# Altium schematic sheet LED_Module.SchDoc: LED Module
size A; Author: Jenova DeBrosse; SheetNumber: 1; SheetTotal: 1; TeamLead: John Ulm; ProjectTitle: LED Module
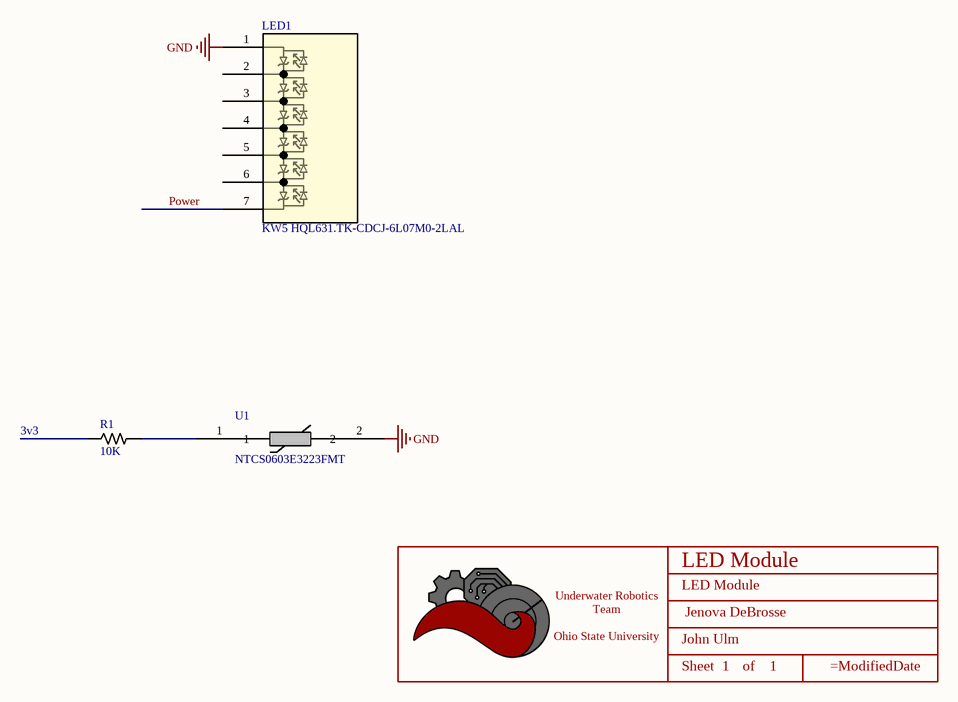
[diagram p0: LED_Module.SchDoc]

## Parts
*  Title_Block  [LOGO]  (value not drawn)  (graphical)
LED1  KW5 HQL631.TK-CDCJ-6L07M0-2LAL  [KW5HQL_OSR]
R1  Value  (Ohms): 10K  [RESISTOR_0603]  (hidden comment: 10k Ohm 0.5% 1/10W)
U1  NTCS0603E3223FMT  [NTCS0603_VIS]

## Nets
GND: LED1.1 U1.2
Power: LED1.7
NetR1_1: R1.1 U1.1

Not connected (* = marked no-connect by the designer): LED1 2 3 4 5 6; R1 2

## Notes on the sheet
- 3v3
- (in symbol Title_Block) Underwater Robotics Team / Ohio State University; Sheet; of

## Library data of the parts
* = Title_Block: UWRT Schematic Title Block Template / Created June 2021, Dylan Trainor
LED1 = KW5 HQL631.TK-CDCJ-6L07M0-2LAL: No Description Available; Mfr_Name: ams OSRAM; Type: LED Lighting; RefDes: RefDes
R1 = RESISTOR_10K_0.5%_0603: RES 10k OHM 0.5% 1/10W 0603; Tolerance: +/- 0.5%; Made By: Robert Pafford; Wattage: 1/10W; Supplier: Digikey; Digikey Part Numer: CR0603-JW-104ELFTR-ND; Supplier 1: Digi-Key; Supplier Part Number 1: 749-1695-1-ND
U1 = CMP-00030-42631939-1: NTCS0603E3223FMT Thermistor NTC 22K Ohm 1% 2-Pin 0603 Surface Mount Solder Pad 3730K -4.5 to -4 T/R Automotive; Resistance: 22kΩ; Power Dissipation: 125mW; Contact Plating: Tin; Accuracy: 1%; Height: 800µm; Max Operating Temperature: 150°C; Termination: SMD/SMT; Case Code (Imperial): 0603; Mount: Surface Mount; Case/Package: 0603; Radiation Hardening: No; Schedule B: 8533400080, 8533400080; Min Operating Temperature: -40°C; Case Code (Metric): 1608; RoHS: Compliant; NexarPartId: 42631939; Number of Pins: 2; Depth: 800µm; Length: 1.6mm; Power Rating: 125mW; Tolerance: 1%; REACH SVHC: Unknown; Width: 1.6mm